# EAGLE design Drone (EAGLE 9.5.2)
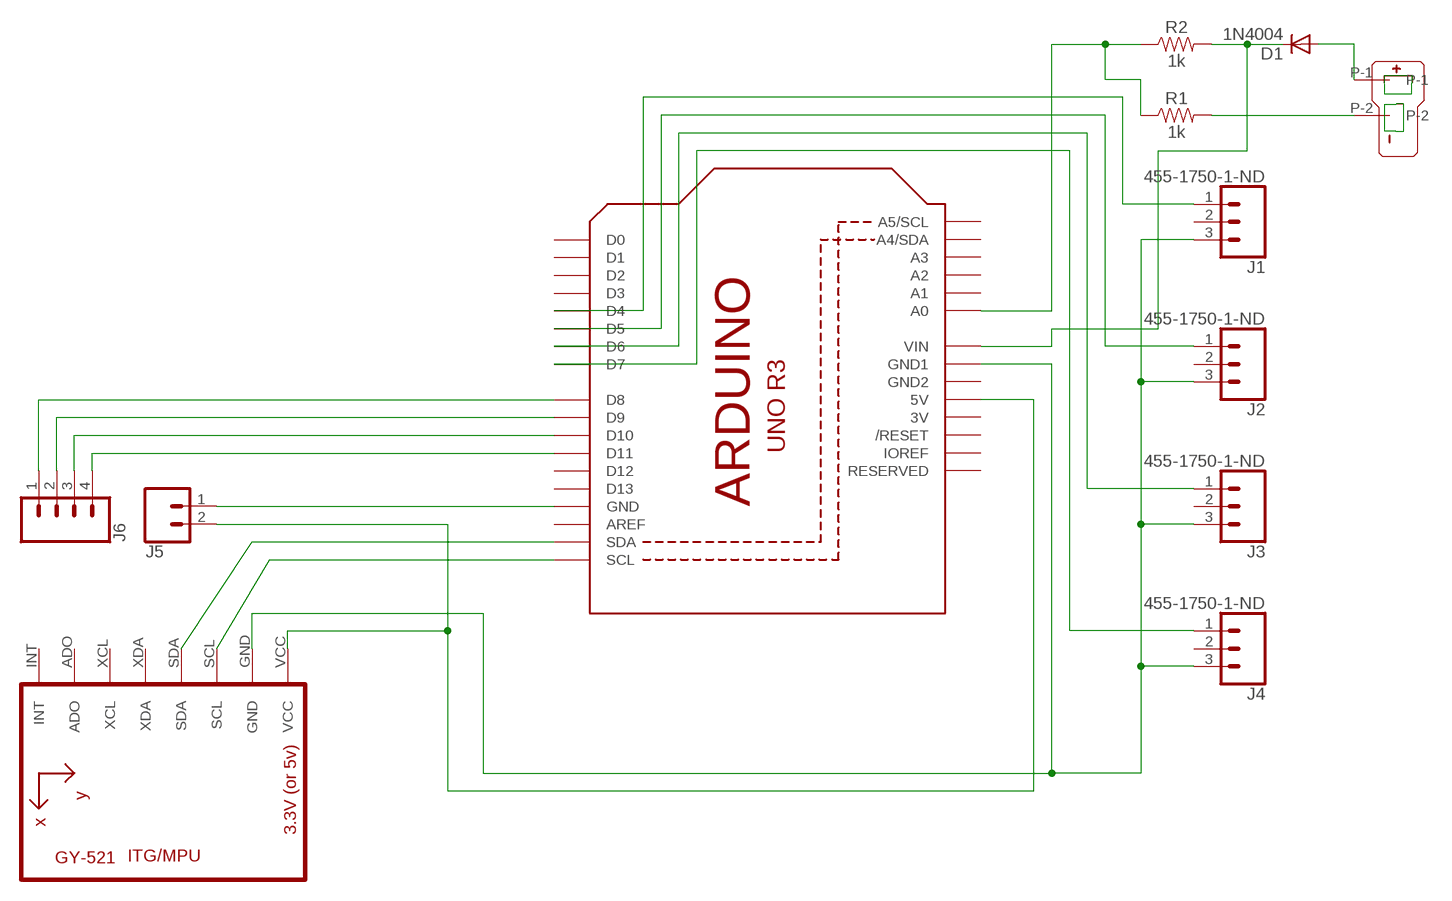
[diagram p0: schematic, sheet 1]

## Parts
D1  1N4004  [DO41-10]
J1  455-1750-1-ND  CONN_03  [1X03]
J2  455-1750-1-ND  CONN_03  [1X03]
J3  455-1750-1-ND  CONN_03  [1X03]
J4  455-1750-1-ND  CONN_03  [1X03]
J5  CONN_02  [1X02]
J6  CONN_04JST-PTH  [JST-4-PTH]
R1  1k  1KOHM-VERT_KIT-1/4W-1%  [AXIAL-0.1-KIT]
R2  1k  1KOHM-VERT_KIT-1/4W-1%  [AXIAL-0.1-KIT]
U1  ARDUINOR3-BPLACE  [ARDUINOR3-BPLACE]
U2  GY-521MPU6050  [GY-521]
U$1  T-PLUG_CONNECTOR  [T_PLUG_CONNECTOR]

## Nets
N$1: U1.SCL U2.SCL
N$2: U1.SDA U2.SDA
N$3: J1.3 J2.3 J3.3 J4.3 U1.GND1 U2.GND
N$4: J4.1 U1.D7
N$5: J3.1 U1.D6
N$6: J2.1 U1.D5
N$7: J1.1 U1.D4
N$8: J5.2 U1.5V U2.VCC
N$9: J6.1 U1.D8
N$10: J6.2 U1.D9
N$11: J6.3 U1.D10
N$12: J6.4 U1.D11
N$13: J5.1 U1.GND
N$14: R1.P$1 R2.P$1 U1.A0
N$15: R1.P$2 U$1.P-2
N$16: D1.C R2.P$2 U1.VIN
N$17: D1.A U$1.P-1
Unconnected: J1.2 J2.2 J3.2 J4.2 U1.A1 U1.A2 U1.A3 U1.A4(A4/SDA) U1.A5(A5/SCL) U1.AREF U1.D0 U1.D1 U1.D2 U1.D3 U1.D12 U1.D13 U1.IOREF U1.RESERVED U1.RESET(/RESET) U2.ADO U2.INT U2.XCL U2.XDA

## Power pins joined to a net without a drawn wire
3V: U1.3V
GND2: U1.GND2

## Library data of the parts
D1 = adafruit:1N4004: DIODE General purpose 1N400x type rectifier (With bigger pads) http://www.ladyada.net/library/pcb/eaglelibrary.html
J1-J4 = SparkFun-Connectors:CONN_03: Multi connection point. Often used as Generic Header-pin footprint for 0.1 inch spaced/style header connections On any of the 0.1 inch spaced packages, you can populate with these: Break Away Headers - Straight <https://www.sparkfun.com/products/116> (PRT-00116) Break Away Male Headers - Right Angle <https://www.sparkfun.com/products/553> (PRT-00553) Female Headers <https://www.sparkfun.com/products/115> (PRT-00115) Break Away Headers - Machine Pin <https://www.sparkfun.com/products/117> (PRT-00117) Break Away Female Headers - Swiss Machine Pin <https://www.sparkfun.com/products/743> (PRT-00743) Stackable Header - 3 Pin (Female, 0.1") <https://www.sparkfun.com/products/13875> (PRT-13875) For SCREWTERMINALS and SPRING TERMINALS visit here: Screw Terimnals on SparkFun.com <https://www.sparkfun.com/search/results?term=Screw+Terminals> (5mm/3.5mm/2.54mm spacing) This device is also useful as a general connection point to wire up your design to another part of your project. Our various solder wires solder well into these plated through hole pads. Hook-Up Wire - Assortment (Stranded, 22 AWG) <https://www.sparkfun.com/products/11375> (PRT-11375) Hook-Up Wire - Assortment (Solid Core, 22 AWG) <https://www.sparkfun.com/products/11367> (PRT-11367) View the entire wire category on our website here <https://www.sparkfun.com/categories/141> Special notes: Molex polarized connector foot print use with SKU : PRT-08232 with associated crimp pins and housings.; PROD_ID: XXX-00000
J5 = SparkFun-Connectors:CONN_02: Multi connection point. Often used as Generic Header-pin footprint for 0.1 inch spaced/style header connections On any of the 0.1 inch spaced packages, you can populate with these: Break Away Headers - Straight <https://www.sparkfun.com/products/116> (PRT-00116) Break Away Male Headers - Right Angle <https://www.sparkfun.com/products/553> (PRT-00553) Female Headers <https://www.sparkfun.com/products/115> (PRT-00115) Break Away Headers - Machine Pin <https://www.sparkfun.com/products/117> (PRT-00117) Break Away Female Headers - Swiss Machine Pin <https://www.sparkfun.com/products/743> (PRT-00743) For SCREWTERMINALS and SPRING TERMINALS visit here: Screw Terimnals on SparkFun.com <https://www.sparkfun.com/search/results?term=Screw+Terminals> (5mm/3.5mm/2.54mm spacing) This device is also useful as a general connection point to wire up your design to another part of your project. Our various solder wires solder well into these plated through hole pads. Hook-Up Wire - Assortment (Stranded, 22 AWG) <https://www.sparkfun.com/products/11375> (PRT-11375) Hook-Up Wire - Assortment (Solid Core, 22 AWG) <https://www.sparkfun.com/products/11367> (PRT-11367) View the entire wire category on our website here <https://www.sparkfun.com/categories/141> Special notes: Molex polarized connector foot print use with: PRT-08233 with associated crimp pins and housings. 2.54_SCREWTERM for use with PRT-10571. 3.5mm Screw Terminal footprints for PRT-08084 5mm Screw Terminal footprints for use with PRT-08432
J6 = SparkFun-Connectors:CONN_04: Multi connection point. Often used as Generic Header-pin footprint for 0.1 inch spaced/style header connections On any of the 0.1 inch spaced packages, you can populate with these: Break Away Headers - Straight <https://www.sparkfun.com/products/116> (PRT-00116) Break Away Male Headers - Right Angle <https://www.sparkfun.com/products/553> (PRT-00553) Female Headers <https://www.sparkfun.com/products/115> (PRT-00115) Break Away Headers - Machine Pin <https://www.sparkfun.com/products/117> (PRT-00117) Break Away Female Headers - Swiss Machine Pin <https://www.sparkfun.com/products/743> (PRT-00743) For SCREWTERMINALS and SPRING TERMINALS visit here: Screw Terimnals on SparkFun.com <https://www.sparkfun.com/search/results?term=Screw+Terminals> (5mm/3.5mm/2.54mm spacing) This device is also useful as a general connection point to wire up your design to another part of your project. Our various solder wires solder well into these plated through hole pads. Hook-Up Wire - Assortment (Stranded, 22 AWG) <https://www.sparkfun.com/products/11375> (PRT-11375) Hook-Up Wire - Assortment (Solid Core, 22 AWG) <https://www.sparkfun.com/products/11367> (PRT-11367) View the entire wire category on our website here <https://www.sparkfun.com/categories/141> Special notes: Molex polarized connector foot print use with SKU : PRT-08231 with associated crimp pins and housings. 1MM SMD Version SKU: PRT-10208; PROD_ID: WIRE-13531; SF_ID: PRT-09916
R1 R2 = SparkFun-Resistors:1KOHM: 1kΩ resistor A resistor is a passive two-terminal electrical component that implements electrical resistance as a circuit element. Resistors act to reduce current flow, and, at the same time, act to lower voltage levels within circuits. - Wikipedia; PROD_ID: RES-12182
U1 = adafruit:ARDUINOR3: This is a new object for the new Arduino R3 - with extra pins that you may want to use (such as IOref, and duplicated A4/A5
U2 = gy-521:GY-521
U$1 = con-T-plug:T-PLUG_CONNECTOR

## Board
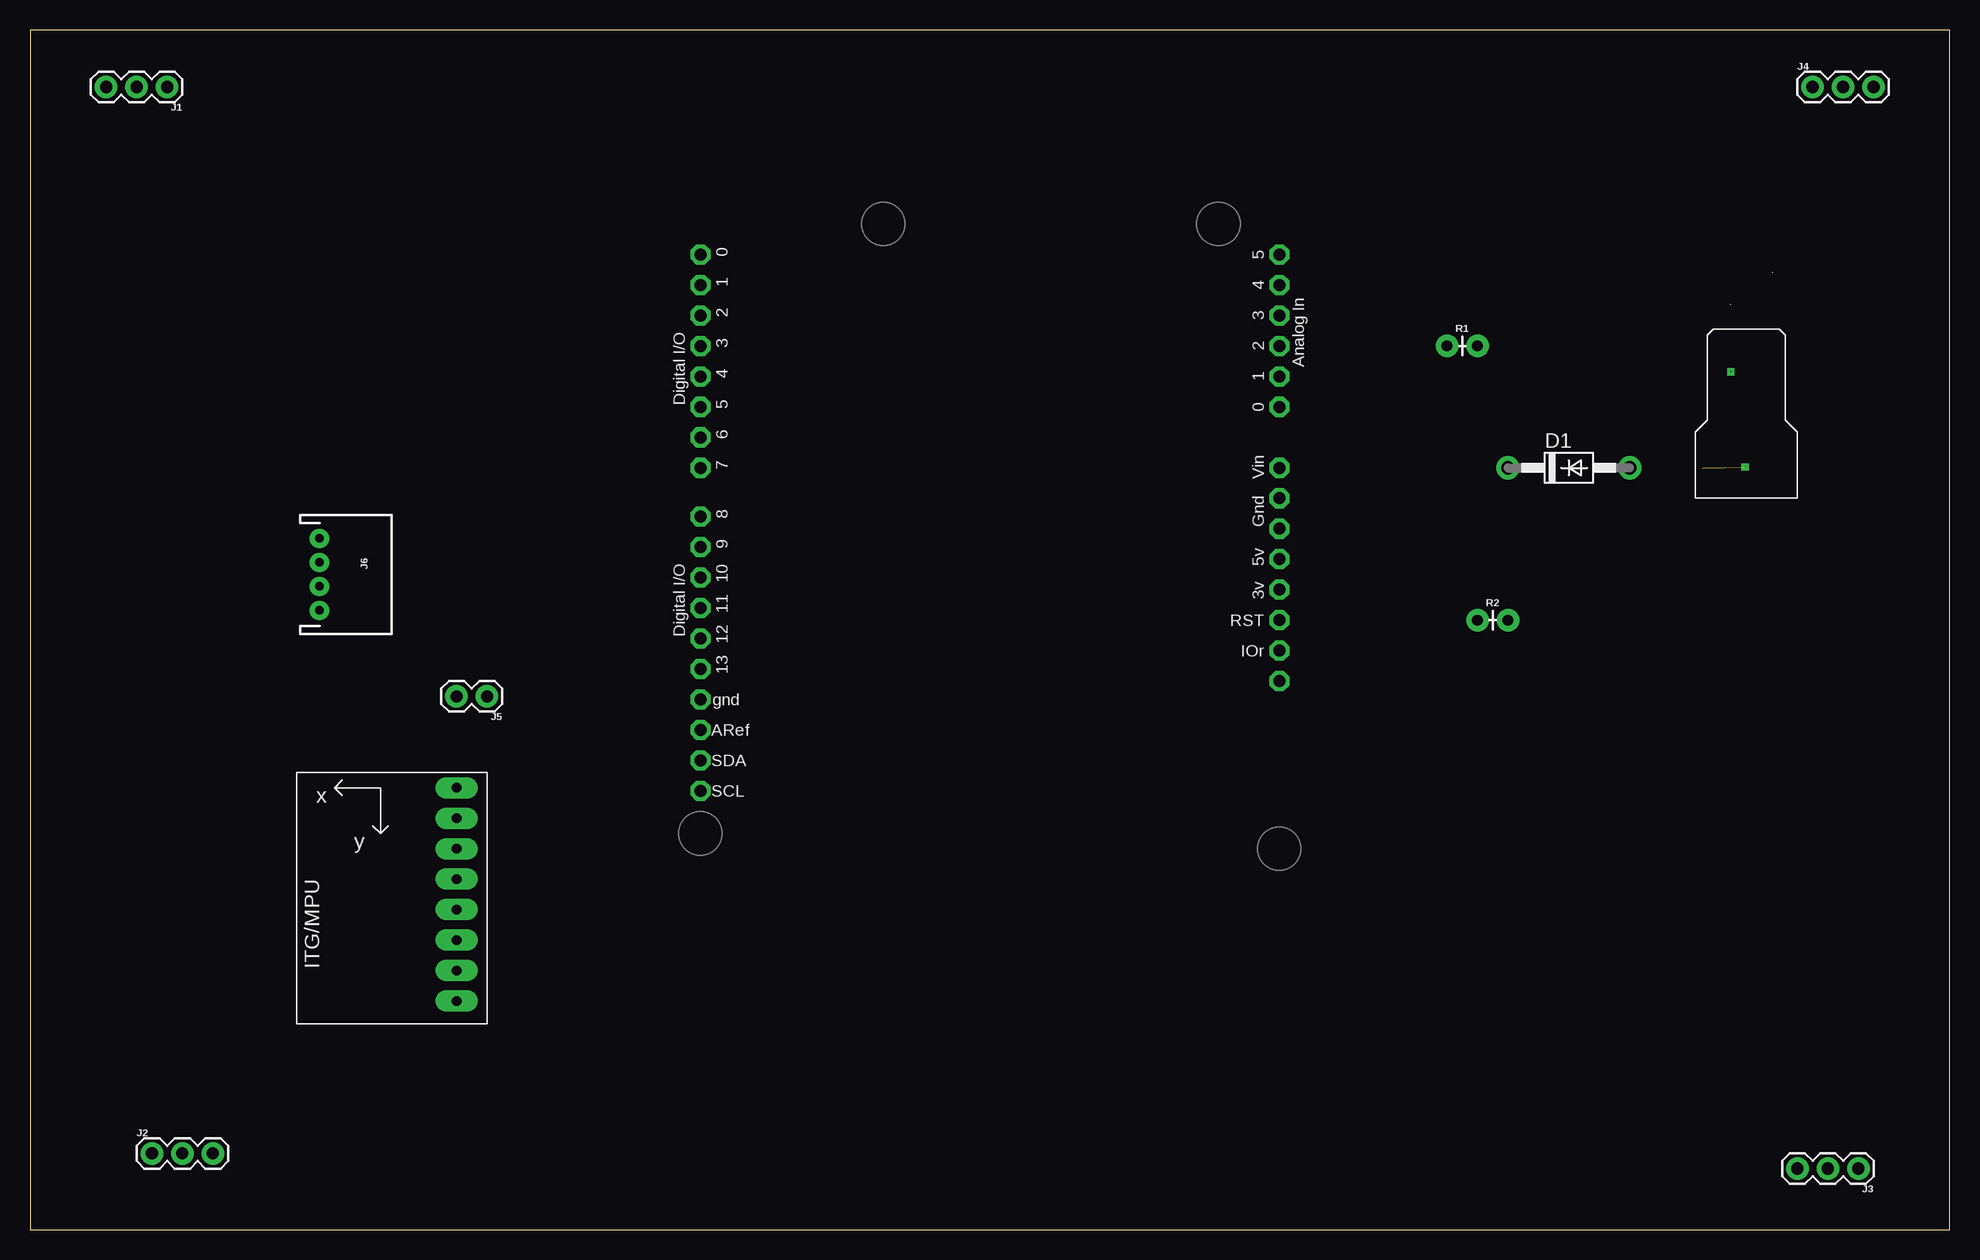
[diagram p1: board, top side]
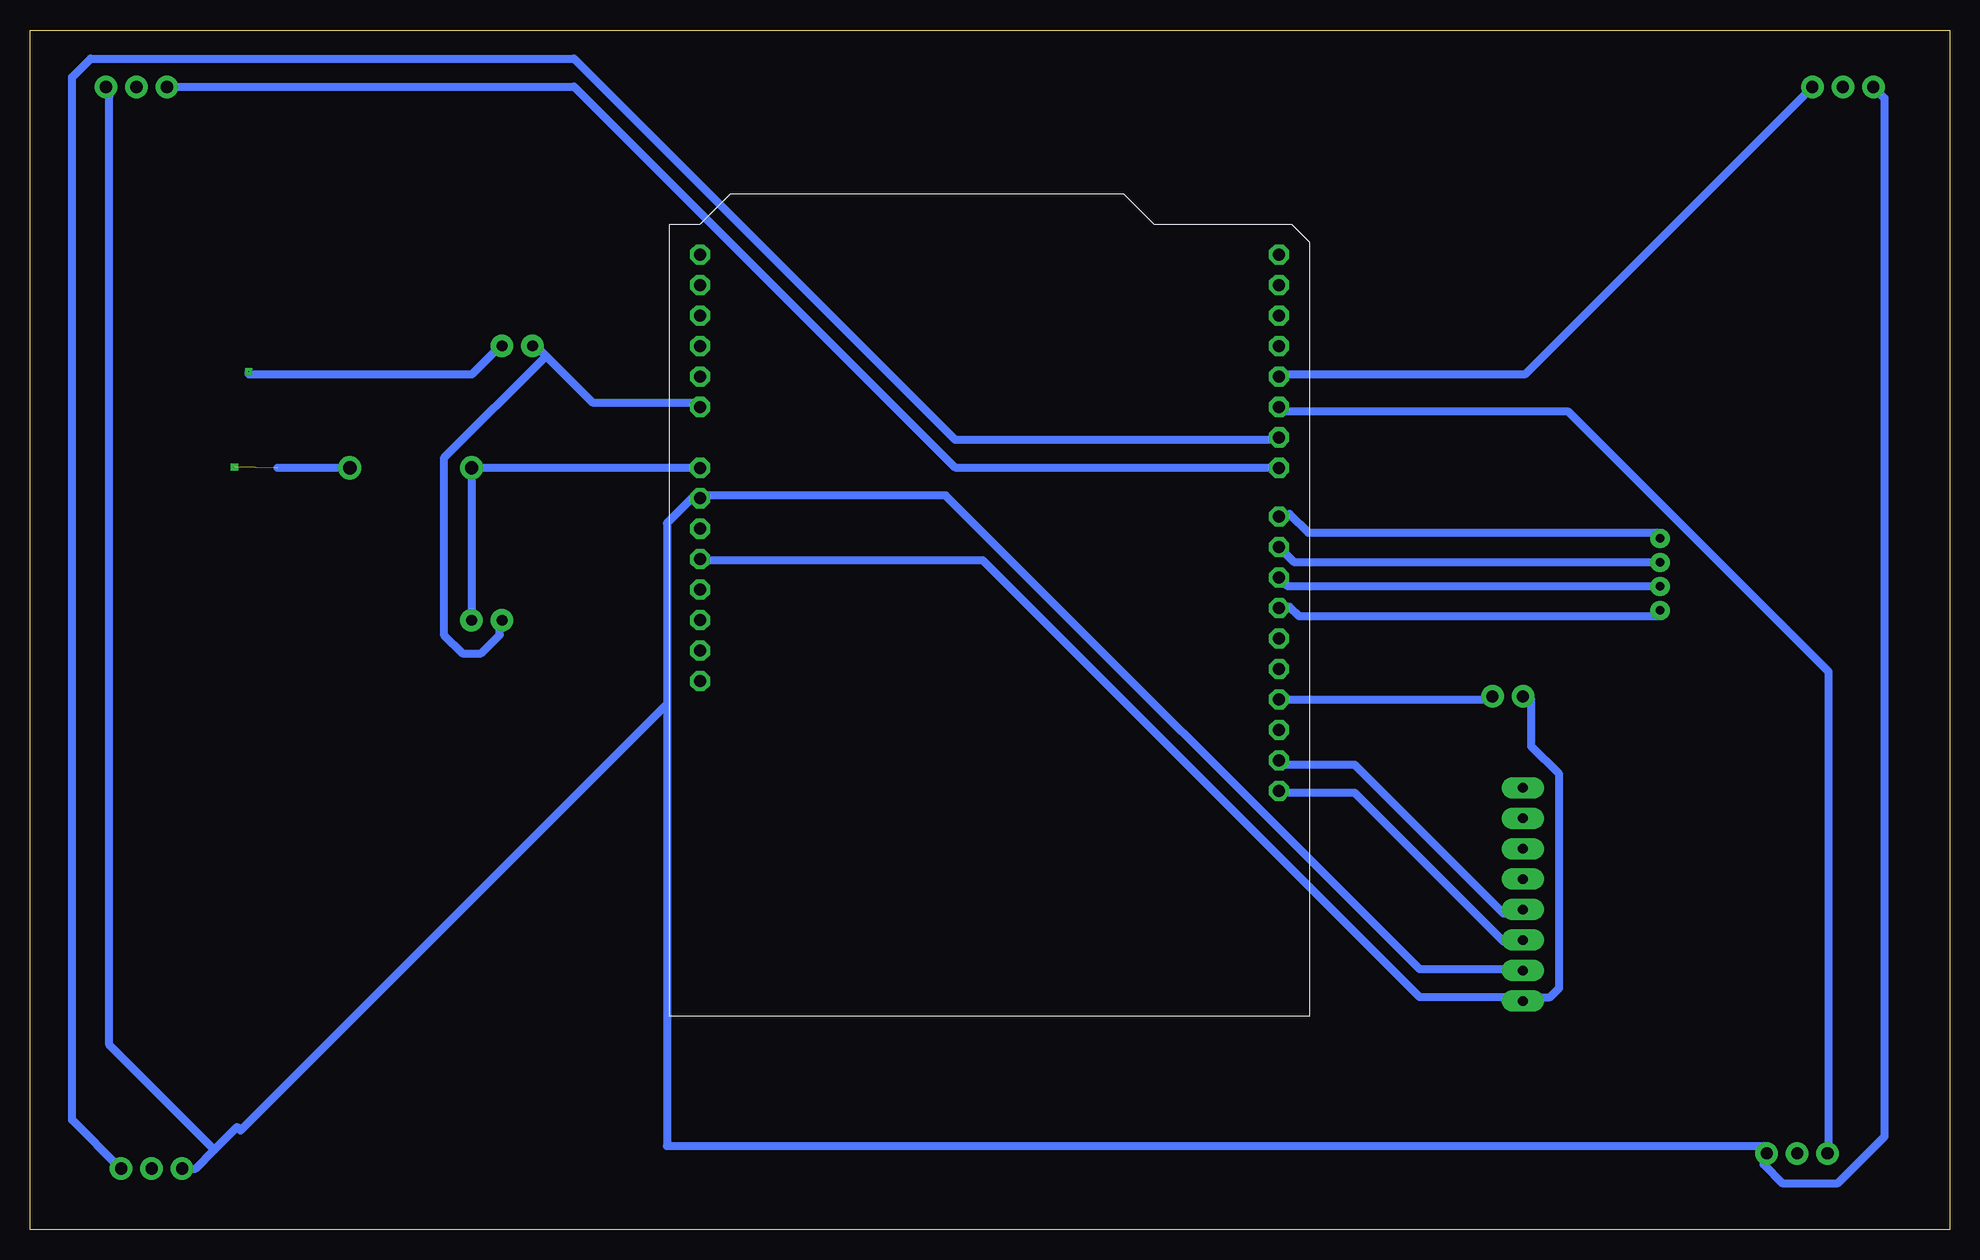
[diagram p2: board, bottom side, seen from below]

Size 160 x 100 mm. Coordinates in mm from the lower left corner, seen from the top.
Outline: 0,0 160,0 160,100 0,100 0,0
Copper layers (1*16): Top 0.035mm / dielectric 1.5mm / Bottom 0.035mm
Design rules "default *": minimum track width 26mil, minimum drill 0.35mm, track to track 35mil, track to pad 35mil, pad to pad 35mil, via to via 35mil, smd to smd 6mil, copper to edge 40mil, drill to drill 6mil, minimum pad ring 10mil, minimum via ring 8mil, stop-mask expansion 4mil, vias tented up to drill 0mil, thermal gap 10mil

### Footprints (pad centres in the part's own frame; a part is rotated, then mirrored left to right if it is on the bottom)
DO41-10 = drill 1.118 pad 1.93: A 5.08,0; C -5.08,0
1X03 = drill 1.016 pad 1.88: 1 0,0; 2 2.54,0; 3 5.08,0
1X02 = drill 1.016 pad 1.88: 1 0,0; 2 2.54,0
JST-4-PTH = drill 0.7 pad 1.6: 1 -3,0; 2 -1,0; 3 1,0; 4 3,0
AXIAL-0.1-KIT = drill 0.9 pad 1.88: P$1 -1.27,0; P$2 1.27,0
ARDUINOR3-BPLACE = drill 1 pad 1.676 octagon: 3V 35.56,2.54; 5V 38.1,2.54; A0 50.8,2.54; A1 53.34,2.54; A2 55.88,2.54; A3 58.42,2.54; A4 60.96,2.54; A5 63.5,2.54; AREF 23.876,50.8; D0 63.5,50.8; D1 60.96,50.8; D2 58.42,50.8; D3 55.88,50.8; D4 53.34,50.8; D5 50.8,50.8; D6 48.26,50.8; D7 45.72,50.8; D8 41.656,50.8; D9 39.116,50.8; D10 36.576,50.8; D11 34.036,50.8; D12 31.496,50.8; D13 28.956,50.8; GND 26.416,50.8; GND1 43.18,2.54; GND2 40.64,2.54; IOREF 30.48,2.54; RESERVED 27.94,2.54; RESET 33.02,2.54; SCL 18.796,50.8; SDA 21.336,50.8; VIN 45.72,2.54
GY-521 = drill 0.8 pad 1.778 long: ADO -8.89,-6.35; GND -8.89,6.35; INT -8.89,-8.89; SCL -8.89,3.81; SDA -8.89,1.27; VCC -8.89,8.89; XCL -8.89,-3.81; XDA -8.89,-1.27
T_PLUG_CONNECTOR = drill 0.1 square: P-1 2.6,4.35; P-2 10.55,5.55

### Placement (x,y rotation side)
D1  128.27,63.5 0 top
J1  11.43,95.25 180 top
J2  10.16,6.35 0 top
J3  152.4,5.08 180 top
J4  148.59,95.25 0 top
J5  38.1,44.45 180 top
J6  24.13,54.61 270 top
R1  119.38,73.66 0 top
R2  121.92,50.8 0 top
U1  106.68,17.78 90 top
U2  26.67,27.94 180 top
U$1  147.32,60.96 90 top

### Tracks (layer width: path | path; a pad name or v marks a point on that pad's centre or on a via)
N$1
  Bottom 0.66: U1.SCL 55.78,36.41 49.58,36.41 37.19,24.02 35.64,24.02 U2.SCL
N$2
  Bottom 0.66: U1.SDA 55.78,38.73 49.58,38.73 37.19,26.34 35.64,26.34 U2.SDA
N$3
  Bottom 0.66: U2.GND 35.64,21.69 44.16,21.69 83.67,61.2 103.81,61.2 U1.GND1 104.58,61.2 106.91,58.88 106.91,43.8 | 106.91,43.8 142.45,8.26 142.74,8.55 144.64,6.64 | 106.91,43.8 106.91,6.97 15.49,6.97 J2.3 15.49,6.2 15.49,5.42 13.95,3.87 9.3,3.87 5.42,7.75 5.42,94.32 J1.3 | J3.3 146.2,5.08 144.64,6.64 | 144.64,6.64 153.39,15.39 153.39,94.51 J4.3
N$4
  Bottom 0.66: U1.D7 56.55,63.52 82.89,63.52 114.66,95.29 147.97,95.29 J4.1
N$5
  Bottom 0.66: U1.D6 56.55,65.85 82.89,65.85 114.66,97.61 154.94,97.61 156.49,96.06 156.49,9.14 152.43,5.08 J3.1
N$6
  Bottom 0.66: U1.D5 55.78,68.17 31.76,68.17 10.07,46.48 10.07,6.97 J2.1
N$7
  Bottom 0.66: U1.D4 55.78,71.27 35.41,71.27 J1.1
N$8
  Bottom 0.66: U1.5V 103.81,55.78 80.57,55.78 44.16,19.37 35.64,19.37 U2.VCC 34.86,19.37 33.31,19.37 32.54,20.14 32.54,37.96 34.86,40.28 34.86,44.16 J5.2
N$9
  Bottom 0.66: J6.1 24.02,58.1 53.45,58.1 55,59.65 55.78,59.65 U1.D8
N$10
  Bottom 0.66: J6.2 54.59,55.61 U1.D9
N$11
  Bottom 0.66: J6.3 55.13,53.61 U1.D10
N$12
  Bottom 0.66: J6.4 24.02,51.13 54.23,51.13 55,51.91 55.78,51.91 U1.D11
N$13
  Bottom 0.66: U1.GND 55.78,44.16 38.73,44.16 J5.1
N$14
  Bottom 0.66: 116.98,72.82 117.75,73.6 R1.P$1 | 116.98,72.82 113.11,68.95 104.58,68.95 U1.A0 | 116.98,72.82 125.5,64.3 125.5,49.58 123.95,48.03 122.4,48.03 120.85,49.58 120.85,50.35 R2.P$1
N$15
  Bottom 0.66: U$1.P-2 141.77,71.27 123.18,71.27 120.85,73.6 R1.P$2
N$16
  Bottom 0.66: U1.VIN 104.58,63.52 123.18,63.52 D1.C 123.18,62.75 123.18,51.13 R2.P$2
N$17  (1 unrouted)
  Bottom 0.66: D1.A 139.38,63.5